# Altium schematic sheet Peak Detector - channel.SchDoc
size A; Organization: Altium Limited; Address1: L3, 12a Rodborough Rd; Address2: Frenchs Forest; Address3: NSW; Address4: Australia 2086; DocumentNumber: 1; SheetNumber: 1; SheetTotal: 3
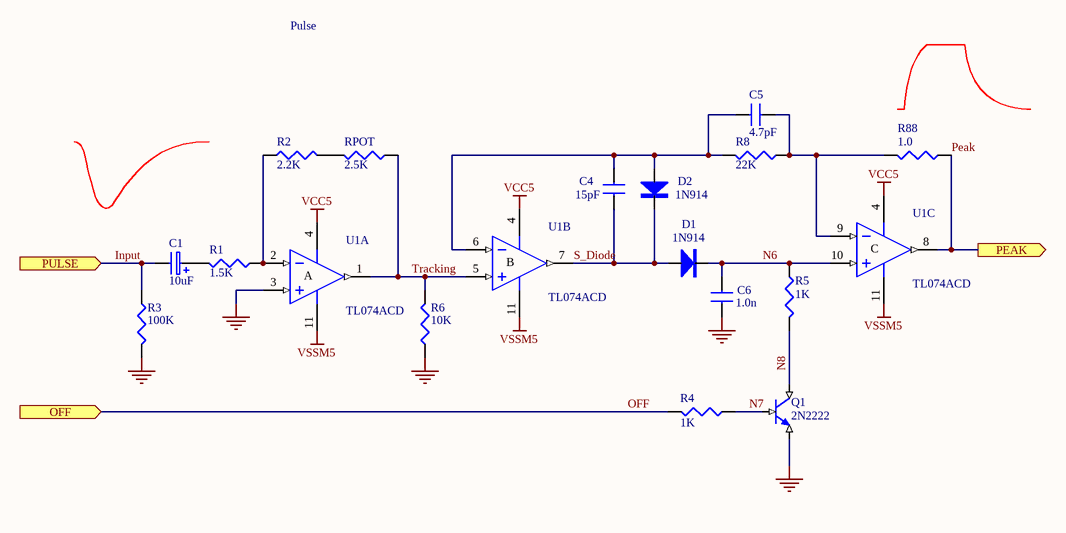
[diagram p0: Peak Detector - channel.SchDoc]

## Parts
C1  10uF  [1206]
C4  15pF  [0805]
C5  4.7pF  [0805]
C6  1.0n  [0805]
D1  1N914  [3216]
D2  1N914  [3216]
Q1  2N2222  [SO-G3/D4.1]
R1  1.5K  [0603]
R2  2.2K  [0603]
R3  100K  [0603]
R4  value 1K  [0603]  (hidden comment: 10K)
R5  1K  [0603]
R6  10K  [0603]
R8  22K  [0603]
R88  1.0  [0603]
RPOT  2.5K  [0603]
U1  TL074ACD  [SO-G14/G3]  (parts A,B,C of 4)

## Ports
OFF (in), PEAK (out), PULSE (in)

## Nets
GND: C6.1 Q1.3(E) R3.1(TOP) R6.2(BOT) U1.3(IN+)
VCC5: U1.4(V+)
VSSM5: U1.11(V-)
Input: C1.2 R3.2(BOT) ; port PULSE
N6: C6.2 D1.2(K) R5.1(TOP) U1.10(IN+)
N7: Q1.2(B) R4.2(BOT)
N8: Q1.1(C) R5.2(BOT)
OFF: R4.1(TOP) ; port OFF
Peak: R88.2(BOT) U1.8(OUT) ; port PEAK
S_Diode: C4.2 D1.1(A) D2.2(K) U1.7(OUT)
Tracking: R6.1(TOP) RPOT.2(BOT) U1.1(OUT) U1.5(IN+)
NetC1_1: C1.1 R1.1(TOP)
NetC4_1: C4.1 C5.1 D2.1(A) R8.1(TOP) U1.6(IN-)
NetC5_2: C5.2 R8.2(BOT) R88.1(TOP) U1.9(IN-)
NetR1_2: R1.2(BOT) R2.2(BOT) U1.2(IN-)
NetR2_1: R2.1(TOP) RPOT.1(TOP)

## Notes on the sheet
- Pulse
- Title
- Size:
- Date:
- A
- Number:
- Time:
- Revision:
- Sheet
- of
- File:
- (in symbol TL074ACD, part A) A
- (in symbol TL074ACD, part B) B
- (in symbol TL074ACD, part C) C

## Library data of the parts
C1 = CAP3: Capacitor; Value: 10uF
C4-C6 = CAP: Capacitor
  C4: Value: 15pF
  C5: Value: 4.7pF
  C6: Value: 1.0n
D1 D2 = 1N914: Diode
Q1 = 2N2222: NPN BJT
R1-R6 R8 R88 RPOT = RES: Resistor
  R1: Value: 1.5K
  R2: Value: 2.2K
  R3: Value: 100K
  R5: Value: 1K
  R6: Value: 10K
  R8: Value: 22K
  R88: Value: 1.0
  RPOT: Value: 2.5K
U1 = TL074ACD: Low-Noise J-FET Quad Operational Amplifier; Text Field7: Published 24-Aug-2001